# EAGLE design untitled (EAGLE 9.6.2)
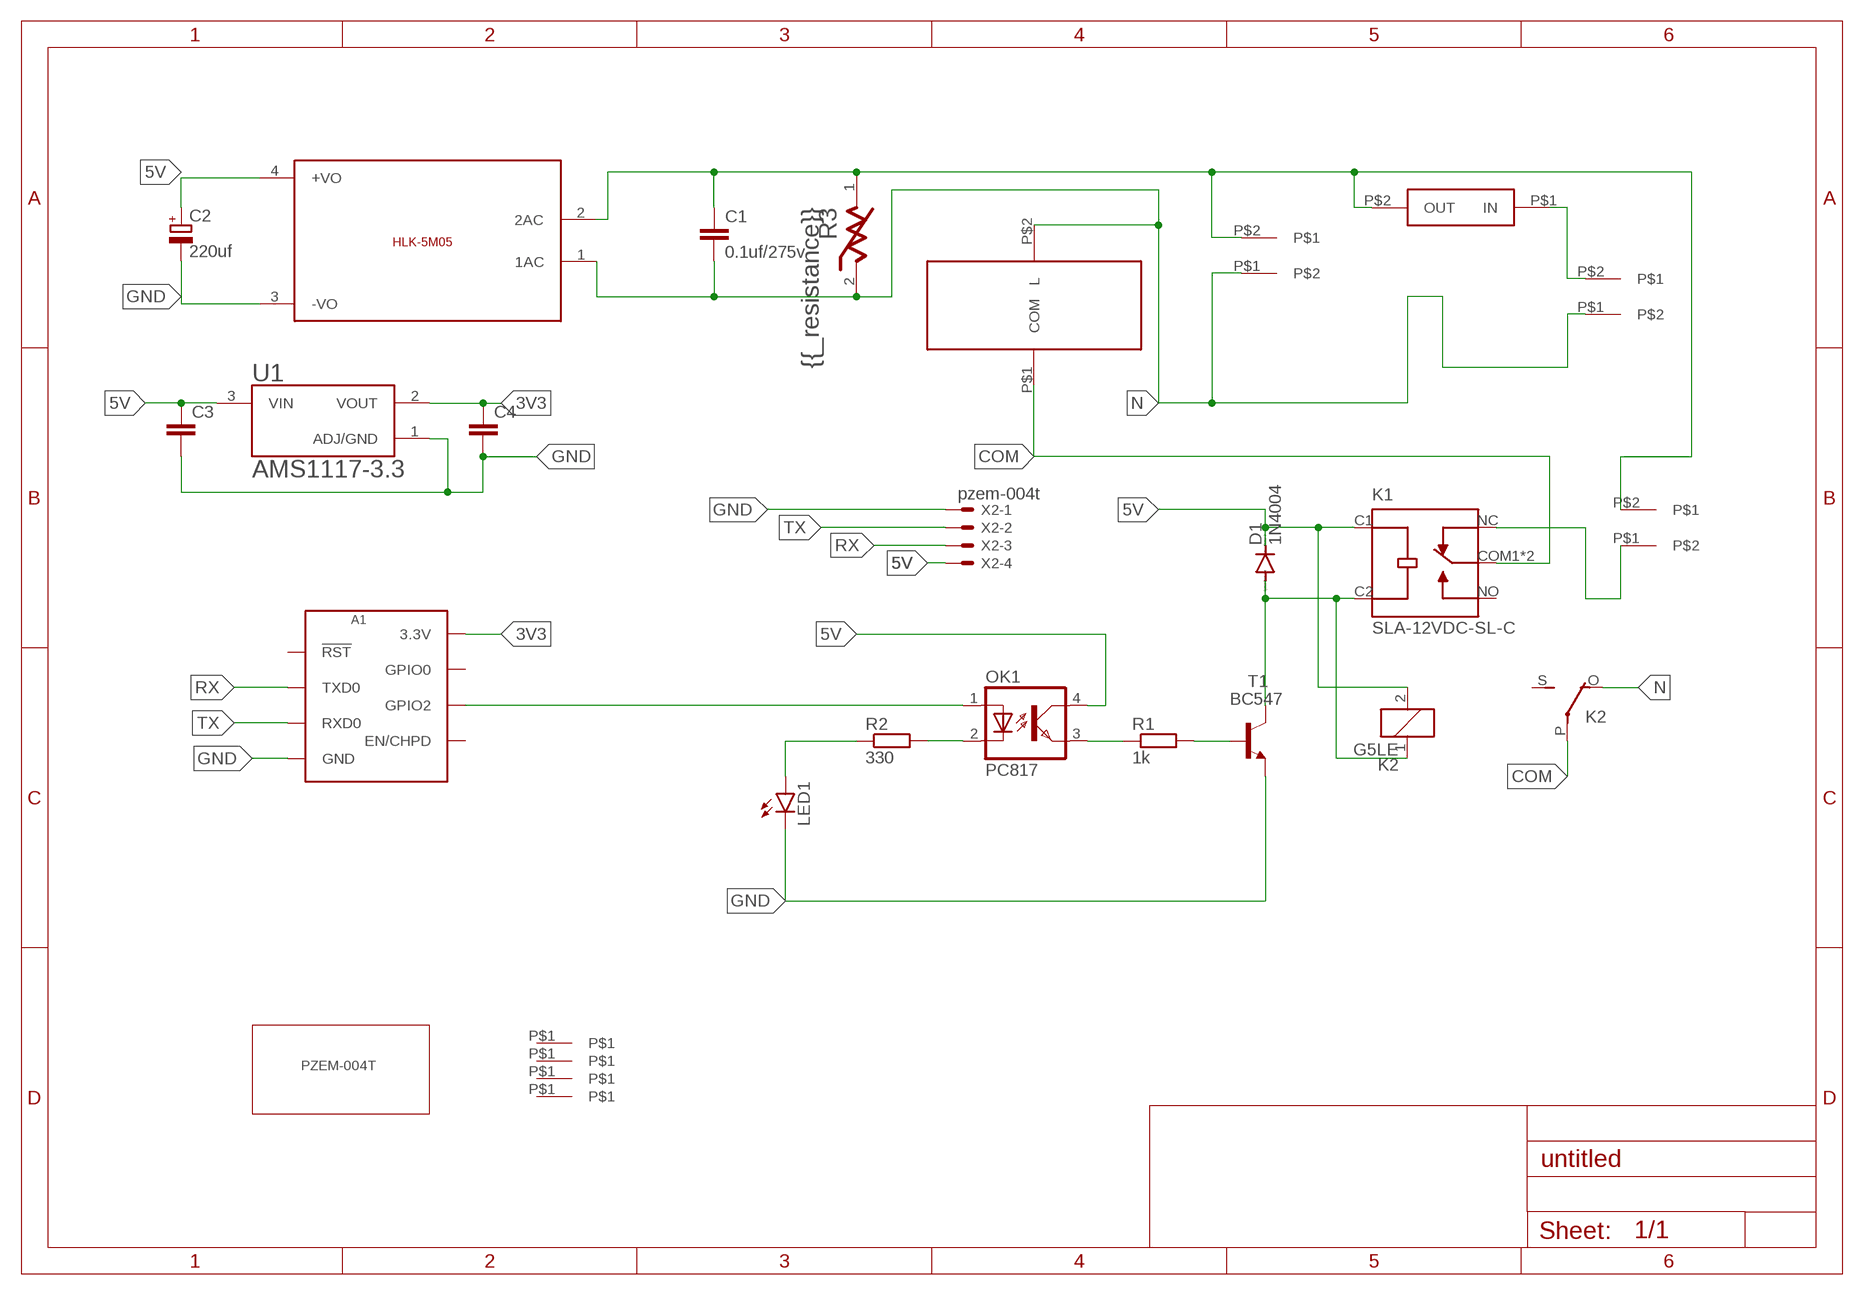
[diagram p0: schematic, sheet 1]

## Parts
220  KF76  [KF76]
A1  ESP8266_ESP-01  [ESP8266_ESP-01_NO-SILKSCREEN]
C1  0.1uf/275v  C7.5/5  [C7.5B5]
C2  220uf  CPOL-EUE2-5  [E2-5]
C3  C-EUC0805  [C0805]
C4  C-EUC0805  [C0805]
D1  1N4004  [DO41-10]
K1  SLA-12VDC-SL-C  [RELAY_SLA-12VDC-SL-C]
K2  G5LE  [G5LE]
LED1  LED5MM  [LED5MM]
OK1  PC817  [DIL04]
PZEM  KF76  [KF76]
R1  1k  R-EU_0207/15  [0207/15]
R2  330  R-EU_0207/15  [0207/15]
R3  10D561K  BOURNS_INC_MOV-10D471KBOURNS_INC_MOV-10D471K_0_0  [BOURNS_INC_MOV-10D471K_0]
RELAY  KF76  [KF76]
T1  BC547  [TO92]
U1  AMS1117-3.3  [SOT229P700X180-4N]
U$1  5VDC/5W  HLK-5M05  [HLK-5M05]
U$2  TOROID  [TOROID]
U$3  PZEM  [PZEM_FOOTPRINT]
U$4  SAPCER  [SPACER]
U$5  SAPCER  [SPACER]
U$6  SAPCER  [SPACER]
U$7  SAPCER  [SPACER]
U$8  FUSE  [FUSE]
X2  pzem-004t  22-23-2041  [22-23-2041]

## Nets
3V3: A1.3V3(3.3V) C4.1 U1.2(VOUT)
5V: C2.+ C3.1 D1.C K1.C1(COIL1) K2.2 OK1.4(COL) U1.3(VIN) U$1.4(+VO) X2.4
COM: K1.COM1(COM) K1.COM2(COM) K2.P(2:P) U$2.P$1(COM)
GND: A1.GND C2.- C3.2 C4.2 LED1.K(C) T1.1(E) U1.1(ADJ/GND) U$1.3(-VO) X2.1
N: 220.P$1 C1.2 K2.O(2:O) PZEM.P$1 R3.2 U$1.1(1AC) U$2.P$2(L)
N$2: OK1.3(EMIT) R1.1
N$3: R1.2 T1.2(B)
N$5: D1.A K1.C2(COIL2) K2.1 T1.3(C)
N$7: C1.1 PZEM.P$2 R3.1 RELAY.P$2 U$1.2(2AC) U$8.P$2(OUT)
N$9: 220.P$2 U$8.P$1(IN)
N$11: K1.NC RELAY.P$1
N$18: LED1.A R2.1
N$19: OK1.2(C) R2.2
N$22: A1.GPIO2 OK1.1(A)
RX: A1.TX(TXD0) X2.3
TX: A1.RX(RXD0) X2.2
Unconnected: A1.EN/CH_PD(EN/CHPD) A1.GPIO0 A1.RST(!RST!) K1.NO K2.S(2:S) U$4.P$1 U$5.P$1 U$6.P$1 U$7.P$1

## Library data of the parts
220 PZEM RELAY = kf76:KF76
A1 = esp01:ESP8266_ESP-?
C1 = capacitor-wima:C: CAPACITOR naming: grid - package width
C2 = rcl:CPOL-EU: POLARIZED CAPACITOR, European symbol; SPICEPREFIX: C
C3 C4 = rcl:C-EU: CAPACITOR, European symbol; SPICEPREFIX: C
D1 = diode:1N4004: DIODE general purpose rectifier, 1 A
K1 = SLA-12VDC-SL-C:SLA-12VDC-SL-C: SUBMINATURE HIGH POWER RELAY Check availability <https://pricing.snapeda.com/parts/SLA-12VDC-SL-C/Songle%20Relay/view-part?ref=eda>; AVAILABILITY: Not in stock; DESCRIPTION: SUBMINATURE HIGH POWER RELAY; MF: Songle Relay; MP: SLA-12VDC-SL-C; PACKAGE: None; PRICE: None
K2 = relay3d:G5LE: RELAY 1 x switch, 10 A/120 V AC, 8 A/30 V DC, Omron; OC_FARNELL: unknown; OC_NEWARK: unknown
LED1 = led:LED: LED OSRAM: - CHIPLED LG R971, LG N971, LY N971, LG Q971, LY Q971, LO R971, LY R971 LH N974, LH R974 LS Q976, LO Q976, LY Q976 LO Q996 - Hyper CHIPLED LW Q18S LB Q993, LB Q99A, LB R99A - SideLED LS A670, LO A670, LY A670, LG A670, LP A670 LB A673, LV A673, LT A673, LW A673 LH A674 LY A675 LS A676, LA A676, LO A676, LY A676, LW A676 LS A679, LY A679, LG A679 - Hyper Micro SIDELED® LS Y876, LA Y876, LO Y876, LY Y876 LT Y87S - SmartLED LW L88C, LW L88S LB L89C, LB L89S, LG L890 LS L89K, LO L89K, LY L89K LS L896, LA L896, LO L896, LY L896 - TOPLED LS T670, LO T670, LY T670, LG T670, LP T670 LSG T670, LSP T670, LSY T670, LOP T670, LYG T670 LG T671, LOG T671, LSG T671 LB T673, LV T673, LT T673, LW T673 LH T674 LS T676, LA T676, LO T676, LY T676, LB T676, LH T676, LSB T676, LW T676 LB T67C, LV T67C, LT T67C, LS T67K, LO T67K, LY T67K, LW E67C LS E67B, LA E67B, LO E67B, LY E67B, LB E67C, LV E67C, LT E67C LW T67C LS T679, LY T679, LG T679 LS T770, LO T770, LY T770, LG T770, LP T770 LB T773, LV T773, LT T773, LW T773 LH T774 LS E675, LA E675, LY E675, LS T675 LS T776, LA T776, LO T776, LY T776, LB T776 LHGB T686 LT T68C, LB T68C - Hyper Mini TOPLED® LB M676 - Mini TOPLED Santana® LG M470 LS M47K, LO M47K, LY M47K Source: http://www.osram.convergy.de LUXEON: - LUMILED® LXK2-PW12-R00, LXK2-PW12-S00, LXK2-PW14-U00, LXK2-PW14-V00 LXK2-PM12-R00, LXK2-PM12-S00, LXK2-PM14-U00 LXK2-PE12-Q00, LXK2-PE12-R00, LXK2-PE12-S00, LXK2-PE14-T00, LXK2-PE14-U00 LXK2-PB12-K00, LXK2-PB12-L00, LXK2-PB12-M00, LXK2-PB14-N00, LXK2-PB14-P00, LXK2-PB14-Q00 LXK2-PR12-L00, LXK2-PR12-M00, LXK2-PR14-Q00, LXK2-PR14-R00 LXK2-PD12-Q00, LXK2-PD12-R00, LXK2-PD12-S00 LXK2-PH12-R00, LXK2-PH12-S00 LXK2-PL12-P00, LXK2-PL12-Q00, LXK2-PL12-R00 Source: www.luxeon.com KINGBRIGHT: KA-3528ASYC Source: www.kingbright.com
OK1 = optocoupler:PC817: SHARP OPTO COUPLER; MPN: PC817X4J000F; OC_FARNELL: 9707727; OC_NEWARK: 97K7059
R1 R2 = rcl:R-EU_: RESISTOR, European symbol; SPICEPREFIX: R
R3 = Bourns Inc. - MOV-10D471K:BOURNS_INC_MOV-10D471K: 470V 2.5kA Varistor 1 Circuit Through Hole Disc 10mm; AUTOMOTIVE: No; CAPACITANCE: 252pF; CENTROID_NOT_SPECIFIED: No; CLAMPING_CURRENT: 25A; CLAMPING_VOLTAGE: 775V; DATASHEET: https://www.bourns.com/docs/product-datasheets/mov10d.pdf?sfvrsn=b57e8a7f_26; DEVICE_CLASS_L1: Circuit Protection; DEVICE_CLASS_L2: Varistors; DEVICE_CLASS_L3: unset; DIGIKEY_DESCRIPTION: VARISTOR 470V 2.5KA DISC 10MM; DIGIKEY_PART_NUMBER: MOV-10D471K-ND; FOOTPRINT_VARIANT_NAME_0: Recommended_Land_Pattern; HEIGHT: 15.5mm; LEAD_FREE: Yes; MF: Bourns Inc.; MOUSER_DESCRIPTION: Var MOV 300VAC/385VDC 2500A 470V Thru-Hole Radial Bulk; MOUSER_PART_NUMBER: 652-MOV-10D471K; MPN: MOV-10D471K; PACKAGE: RADIAL; PREFIX: R; ROHS: Yes; TEMPERATURE_RANGE_HIGH: +105°C; TEMPERATURE_RANGE_LOW: -40°C; VARISTOR_VOLTAGE: 470V; VERIFICATION_VERSION: 0.0.0.3; VOLTAGE_RATING_AC: 300V; VOLTAGE_RATING_DC: 385V; VOLTAGE_TOLERANCE: 10%
T1 = transistor:BC547: NPN TRANSISTOR
U1 = AMS1117-3.3:AMS1117-3.3: Sot223/Pkg 1-Amp 3.3-Volt Low Drop Out Voltage Regulatator Check availability <https://pricing.snapeda.com/parts/AMS1117-3.3/Advanced%20Monolithic%20Systems/view-part?ref=eda>; AVAILABILITY: Not in stock; DESCRIPTION: Sot223/Pkg 1-Amp 3.3-Volt Low Drop Out Voltage Regulatator; MF: Advanced Monolithic Systems; MP: AMS1117-3.3; PACKAGE: SOT-223 Seeed Technology; PRICE: None
U$1 = HLK-5M05:HLK-5M05: HLK-5M05 is an 5Volt/5W smps developed by HI-LINK; SIZE: 23x38(mm)
U$2 = TOROID:TOROID
U$3 = pzem30mmm:PZEM
U$4-U$7 = spacer:SAPCER
U$8 = fuse3d:FUSE
X2 = con-molex:22-23-2041: .100" (2.54mm) Center Header - 4 Pin; MF: MOLEX; MPN: 22-23-2041; OC_FARNELL: 1462920; OC_NEWARK: 38C0355

## Board
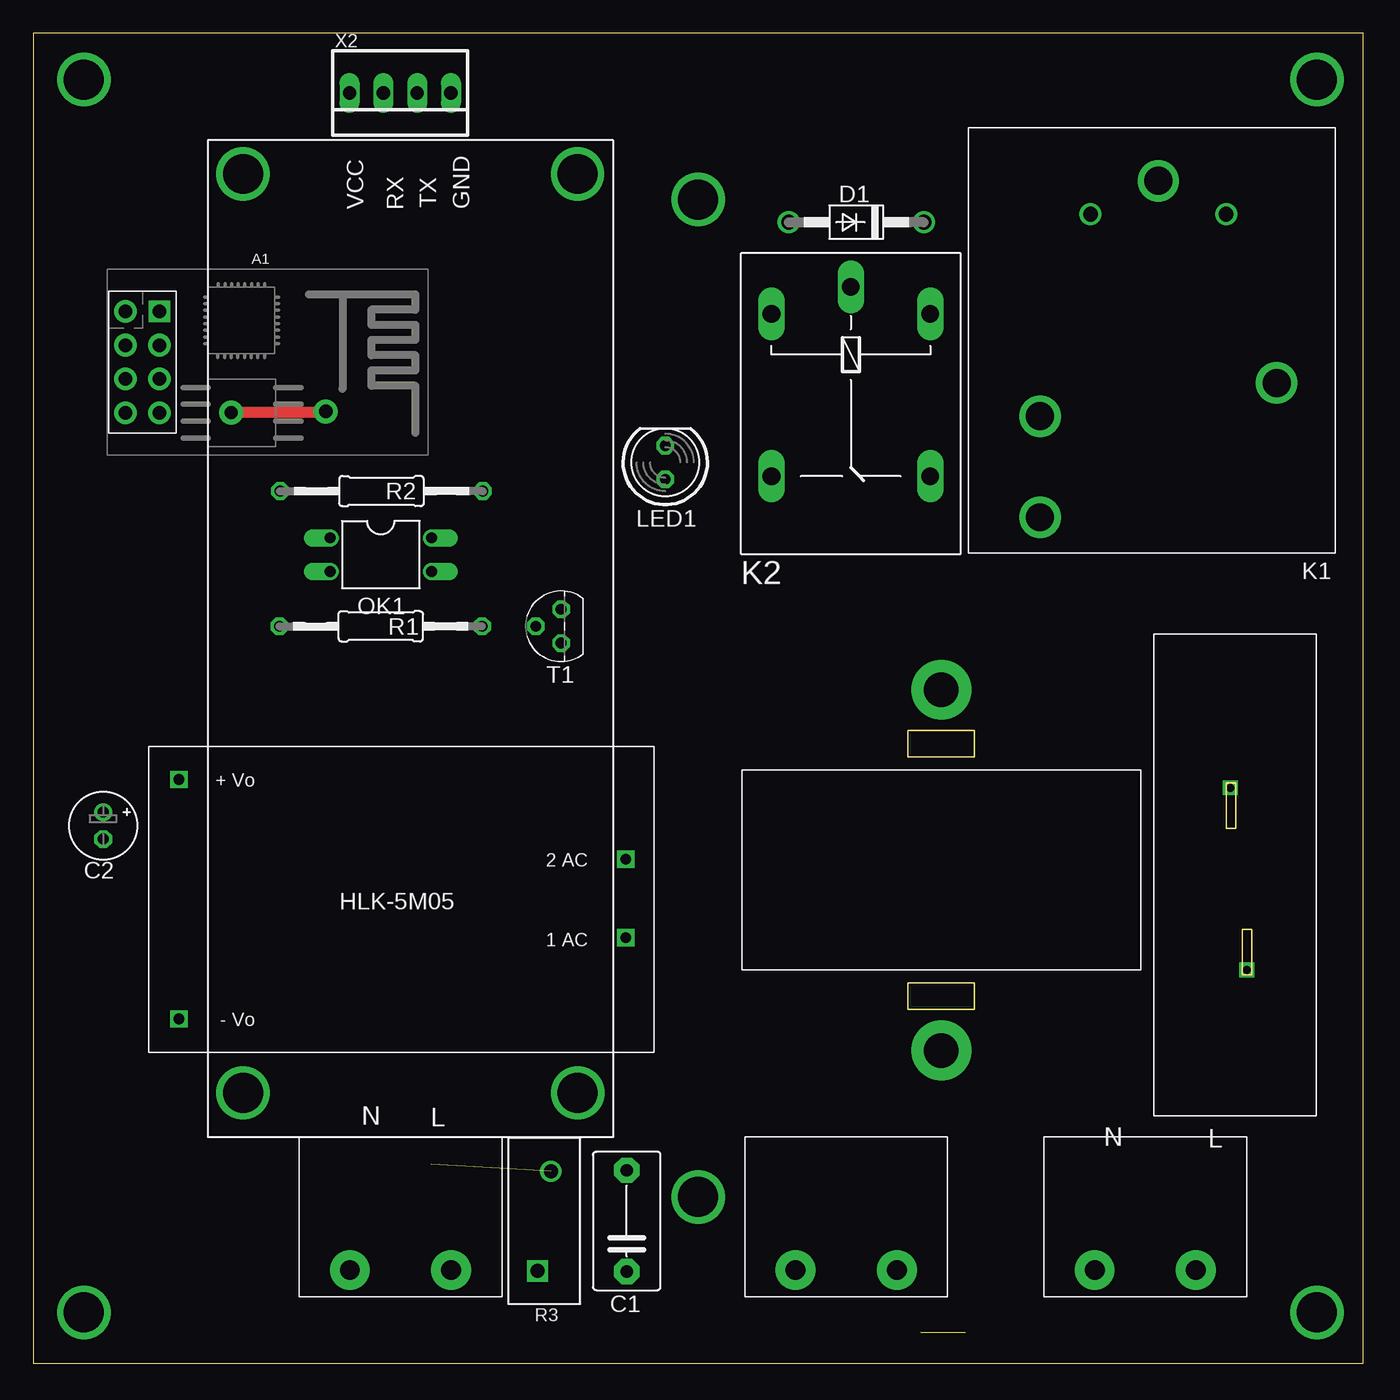
[diagram p1: board, top side]
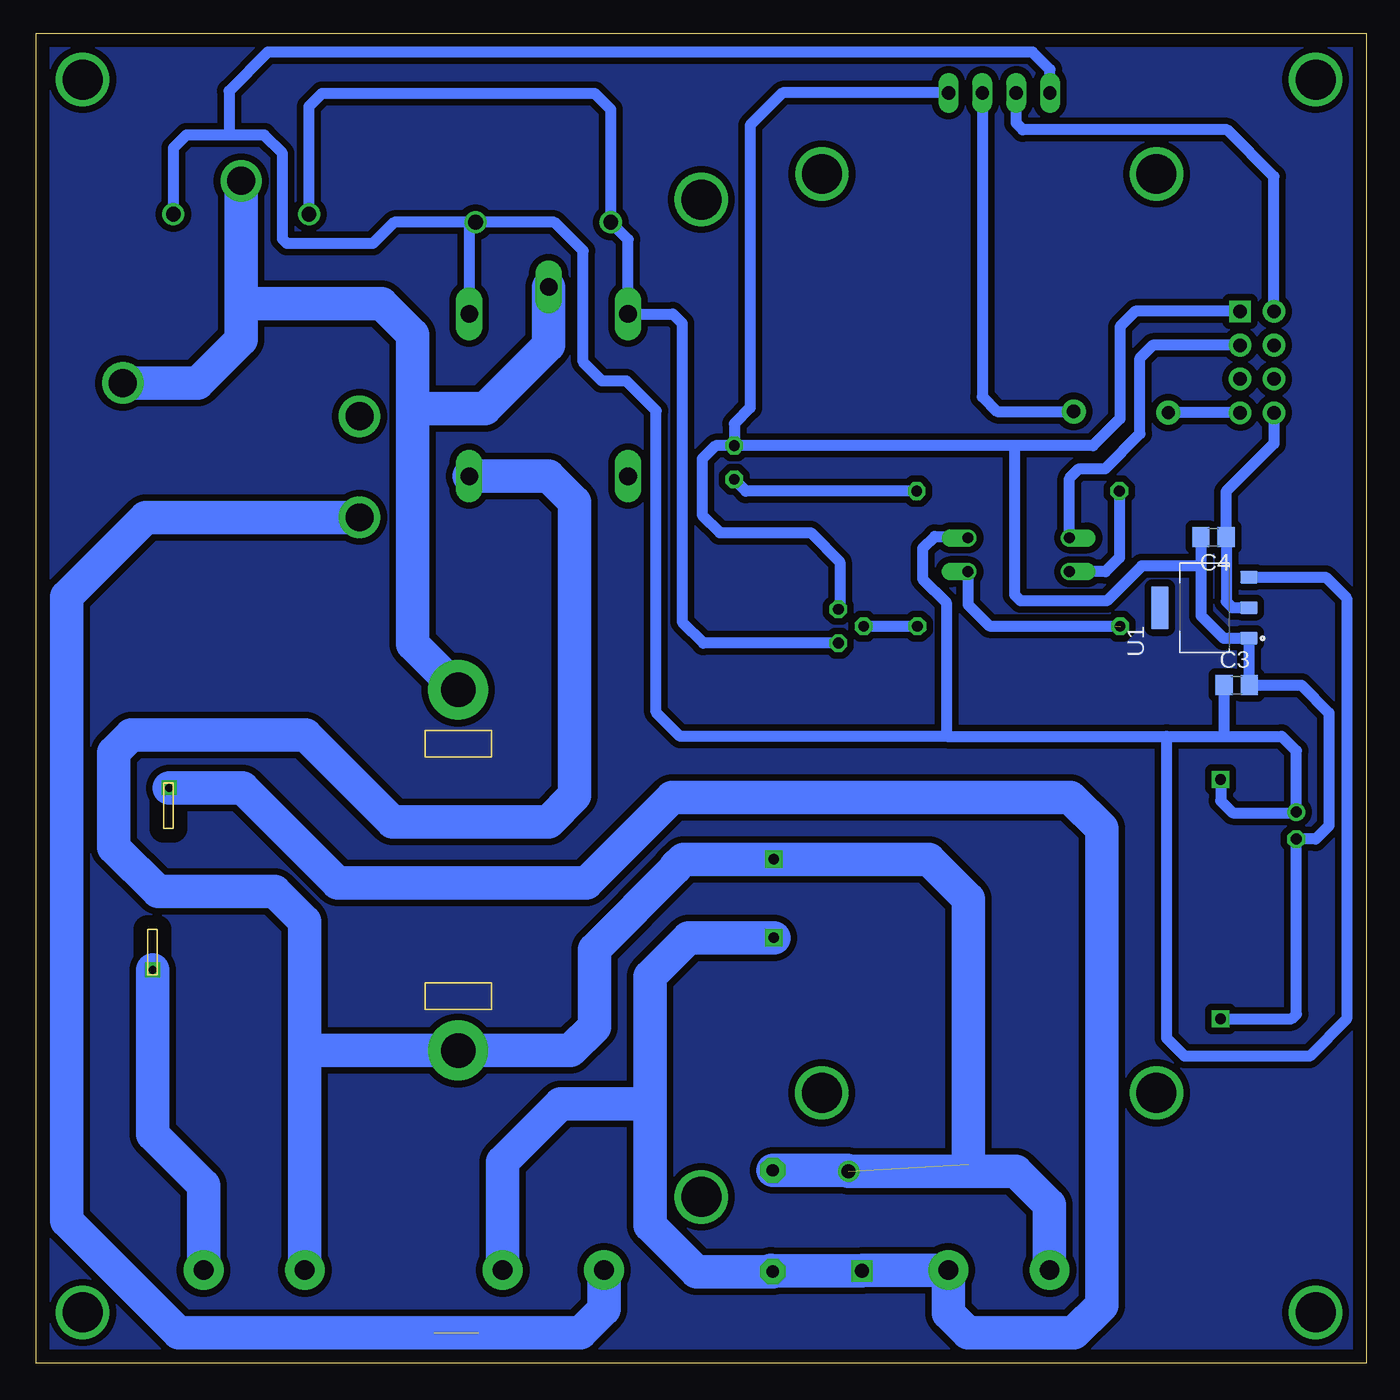
[diagram p2: board, bottom side, seen from below]

Size 100 x 100 mm. Coordinates in mm from the lower left corner, seen from the top.
Outline: 0,0 100,0 100,100 0,100 0,0
Copper layers (1*16): Top 0.035mm / dielectric 1.5mm / Bottom 0.035mm
Design rules "default *": minimum track width 6mil, minimum drill 0.8mm, track to track 0.5mm, track to pad 0.5mm, pad to pad 0.5mm, via to via 0.5mm, smd to smd 0.5mm, copper to edge 40mil, drill to drill 6mil, minimum pad ring 10mil, minimum via ring 8mil, stop-mask expansion 4mil, vias tented up to drill 0mil, thermal gap 10mil

### Footprints (pad centres in the part's own frame; a part is rotated, then mirrored left to right if it is on the bottom)
KF76 = drill 1.5 pad 3: P$1 3.81,2; P$2 11.43,2
ESP8266_ESP-01_NO-SILKSCREEN = drill 1.016 pad 1.7: 3V3 -1.27,-3.81; EN/CH_PD -1.27,1.27; GPIO0 1.27,-1.27; GPIO2 1.27,1.27; RST -1.27,-1.27; RX 1.27,-3.81; TX -1.27,3.81 | drill 1.016 pad 1.6 square: GND 1.27,3.81
C7.5B5 = drill 0.914 pad 1.905 octagon: 1 -3.81,0; 2 3.81,0
E2-5 = drill 0.813 pad 1.27: + -1.016,0 | drill 0.813 pad 1.27 octagon: - 1.016,0
C0805 = smd 1.3 x 1.5: 1 -0.95,0; 2 0.95,0
DO41-10 = drill 1.118: A 5.08,0; C -5.08,0
RELAY_SLA-12VDC-SL-C = drill 1.1: C1 -5.1,-15.2; C2 5.1,-15.2 | drill 2.1: COM1 0,-17.7; COM2 -8.9,-2.5; NC 8.9,7.6; NO 8.9,0
G5LE = drill 1.321 long: 1 -7.493,-5.969; 2 -7.493,5.969; O 4.699,5.969; P -9.525,0; S 4.699,-5.969
LED5MM = drill 0.813 octagon: A -1.27,0; K 1.27,0
DIL04 = drill 0.813 offset: 1 -1.27,-3.81; 2 1.27,-3.81; 3 1.27,3.81; 4 -1.27,3.81
0207/15 = drill 0.813 octagon: 1 -7.62,0; 2 7.62,0
BOURNS_INC_MOV-10D471K_0 = drill 1.05 pad 1.6 square: 1 -3.75,0.5 | drill 1.05 pad 1.6: 2 3.75,-0.5
TO92 = drill 0.813 octagon: 1 1.27,0; 2 0,1.905; 3 -1.27,0
SOT229P700X180-4N = smd 0.93 x 1.31: 1 -2.29,-3.345; 2 0,-3.345; 3 2.29,-3.345 | smd 3.24 x 1.31: 4 0,3.345
HLK-5M05 = drill 0.8 square: 1 -16.85,-2.93; 2 -16.85,2.97; 3 16.75,9.07; 4 16.75,-8.93
TOROID = drill 2.6 pad 4.5: P$1 15,21.05; P$2 15,-6.08
SPACER = drill 3: P$1 0,0
FUSE = drill 0.6 pad 0.1 square: P$1 -6.85,-0.6; P$2 6.85,0.65
22-23-2041 = drill 1 long: 1 -3.81,0; 2 -1.27,0; 3 1.27,0; 4 3.81,0

### Placement (x,y rotation side)
220  76,5 0 top
A1  8.21,75.28 0 top
C1  44.63,10.69 90 top
C2  5.26,40.42 270 top
C3  9.75,50.98 0 bottom
C4  11.48,62.1 180 bottom
D1  61.89,85.79 180 top
K1  84.6,71.2 180 top
K2  61.48,71.4 270 top
LED1  47.52,67.72 90 top
OK1  26.13,60.79 270 top
PZEM  20,5 0 top
R1  26.13,55.41 0 top
R2  26.19,65.57 180 top
R3  38.42,10.68 90 top
RELAY  53.5,5 0 top
T1  39.69,55.41 90 top
U1  12.17,56.8 90 bottom
U$1  27.69,34.96 180 top
U$2  53.28,29.59 0 top
U$3  43.6,91.94 180 top
U$4  15.78,20.32 0 top
U$5  40.94,20.32 0 top
U$6  15.77,89.42 0 top
U$7  40.93,89.42 0 top
U$8  90.66,36.41 90 top
X2  27.6,95.52 180 top

### Tracks (layer width: path | path; a pad name or v marks a point on that pad's centre or on a via)
3V3
  Bottom 0.813: U1.2 10.06,56.8 10.53,57.28 C4.1 10.55,62.12 10.55,65.52 6.94,69.13 A1.3V3
5V
  Bottom 0.813: D1.C 67.45,85.31 K2.2 | X2.4 23.79,97.26 25.1,98.58 82.59,98.58 85.52,95.65 85.52,92.35 | D1.C 73.09,85.79 74.7,84.18 81.14,84.18 81.49,84.53 81.49,90.97 82.87,92.35 85.52,92.35 | K1.C1 89.7,91.37 88.72,92.35 85.52,92.35 | 10.71,47.14 6.36,47.14 5.26,46.04 C2.+ 5.33,41.37 10.04,41.37 10.94,42.28 U$1.4 | C3.1 10.7,47.15 10.71,47.14 | OK1.4 30.05,62.16 32.45,62.16 33.36,61.25 33.36,58.98 31.58,57.2 31.58,47.18 31.54,47.14 | 31.54,47.14 15,47.14 | 15,47.14 10.71,47.14 | 31.54,47.14 51.59,47.14 53.4,48.94 53.4,71.61 55.64,73.86 57.47,73.86 58.89,75.28 58.89,83.64 61.04,85.79 D1.C | U1.3 3.05,59.09 1.48,57.52 1.48,25.87 4.26,23.08 13.65,23.08 15,24.43 15,47.14
COM
  Bottom 2.5: K1.COM1 84.6,79.66 | 84.6,79.66 84.6,76.95 87.85,73.7 K1.COM2 | 84.6,79.66 74.03,79.66 71.72,77.36 71.72,72.32 | 71.72,72.32 71.72,54.08 U$2.P$1 | K2.P 61.48,76.56 66.25,71.79 71.19,71.79 71.72,72.32
GND
  Bottom 0.813: C3.2 | C3.2 4.88,50.98 2.8,48.9 2.8,40.41 3.8,39.41 C2.- 5.26,26.23 5.6,25.89 U$1.3 | 31.33,95.44 X2.1 43.88,95.52 46.33,93.07 46.33,71.83 47.52,70.64 LED1.K | LED1.K 48.93,68.99 49.93,67.99 49.93,63.77 48.6,62.44 41.77,62.44 39.58,60.25 39.58,56.79 T1.1 | LED1.K 47.2,68.99 26.43,68.99 | A1.GND 17.37,79.09 18.53,77.93 18.53,71.01 20.55,68.99 26.43,68.99 | C3.2 8.83,51 U1.1 10.73,54.51 12.43,56.21 12.43,59.86 | C4.2 12.43,59.86 | 12.43,59.86 12.52,59.94 16.89,59.94 19.51,57.32 25.98,57.32 26.43,57.77 26.43,68.99
N  (1 unrouted)
  Bottom 2.5: PZEM.P$1 23.81,11.89 26.35,14.43 R3.2 39,14.5 C1.2 | 220.P$1 79.81,23.5 | 29.91,14.96 29.91,34.9 32.89,37.89 U$1.1 51.35,37.89 51.94,37.29 51.94,37.22 58.04,31.13 58.04,25.29 59.83,23.5 U$2.P$2 79.81,23.5 | K2.O 61.47,66.7 59.51,64.74 59.51,42.69 61.49,40.71 73.22,40.71 79.74,47.23 92.86,47.23 94.17,45.92 94.17,38.78 90.85,35.46 82.07,35.46 79.81,33.2 79.81,23.5
N$1
  pour Bottom: 0,0 0,100 100,100 100,0
N$2  (1 unrouted)
  Bottom 0.813: OK1.3 29.94,57.03 28.34,55.43 18.81,55.43
N$3
  Bottom 0.813: R1.2 T1.2
N$4  (via drill 3)
  other vias: 50,87.5
N$5
  Bottom 0.813: K1.C2 79.5,94.5 78.51,95.49 58.02,95.49 56.81,94.28 D1.A 55.51,84.48 K2.1 52.13,78.89 51.45,78.2 51.45,55.73 49.85,54.14 T1.3
N$6  (via drill 3)
  other vias: 50,12.5
N$7
  Bottom 2.5: U$1.2 44.55,31.98 50.97,31.98 53.86,29.09 53.86,19.48 | C1.1 44.58,6.93 R3.1 37.85,7 PZEM.P$2 31.43,3.75 29.95,2.27 21.98,2.27 19.9,4.35 19.9,40.19 22.25,42.54 52.2,42.54 58.63,36.12 77.36,36.12 84.5,43.26 U$8.P$2 | C1.1 44.74,7 | C1.1 50.38,6.88 53.86,10.36 53.86,19.48 | RELAY.P$2 64.93,15.15 60.6,19.48 53.86,19.48
N$9
  Bottom 2.5: U$8.P$1 91.26,17.2 87.43,13.37 220.P$2
N$10  (via drill 3)
  other vias: 3.81,96.52
N$11  (1 unrouted)
  Bottom 2.5: 66.73,2.28 89.3,2.28 97.73,10.72 97.73,57.65 91.78,63.6 K1.NC | RELAY.P$1 57.31,4.03 59.08,2.27 70.11,2.27
N$12  (via drill 3)
  other vias: 96.52,96.52
N$13  (via drill 3)
  other vias: 96.52,3.81
N$14  (via drill 3)
  other vias: 3.81,3.81
N$18
  Bottom 0.813: R2.1 46.64,65.57 LED1.A
N$19
  Bottom 0.813: R2.2 18.57,60.56 19.61,59.52 OK1.2
N$22
  Bottom 0.813: A1.GPIO2 16.06,76.55 17.01,75.59 17.01,69.88 19.63,67.26 21.61,67.26 22.32,66.55 OK1.1
RX
  Bottom 0.813: A1.TX 6.94,89.23 10.45,92.74 25.83,92.74 26.33,93.24 X2.3
TX  (via drill 1 pad 1.8)
  Top 0.813: v22,71.56 21.52,71.47 v14.88,71.47
  Bottom 0.813: A1.RX v14.87,71.47 v14.88,71.47 | X2.2 28.87,72.67 27.76,71.56 v22,71.56

### Text on the board
tNames: VCC | RX | TX | GND | N | L | N | L